# Altium schematic sheet Sheet1.SchDoc
size A; SheetNumber: 1; SheetTotal: 1
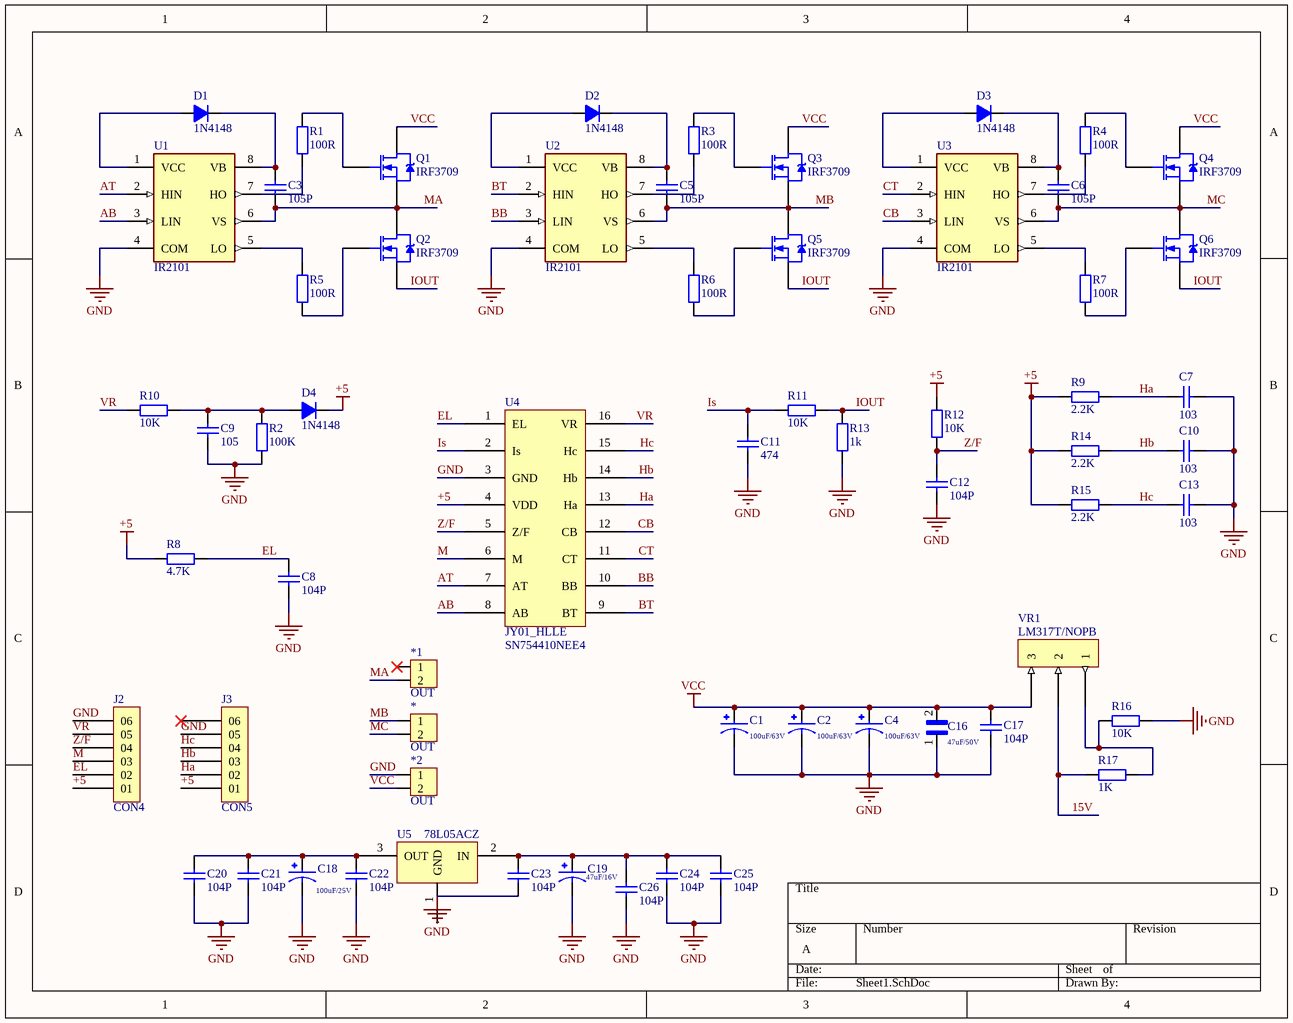
[diagram p0: Sheet1.SchDoc]

## Parts
*  OUT  [VH3.96M-2 CONG]
*1  OUT  [VH3.96M-2 CONG]
*2  OUT  [VH3.96M-2 CONG]
C1  100uF/63V  [CAP_EEVTG1J101Q]
C2  100uF/63V  [CAP_EEVTG1J101Q]
C3  105P  [tu 0805]
C4  100uF/63V  [CAP_EEVTG1J101Q]
C5  105P  [tu 0805]
C6  105P  [tu 0805]
C7  103  [tu 0805]
C8  104P  [tu 0805]
C9  105  [tu 0805]
C10  103  [tu 0805]
C11  474  [tu 0805]
C12  104P  [tu 0805]
C13  103  [tu 0805]
C16  47uF/50V  [CAPC6050X550N]
C17  104P  [tu 0805]
C18  100uF/25V  [CAP_EEEHA1E101AP]
C19  47uF/16V  [CAP_EEE1CA470AP]
C20  104P  [tu 0805]
C21  104P  [tu 0805]
C22  104P  [tu 0805]
C23  104P  [tu 0805]
C24  104P  [tu 0805]
C25  104P  [tu 0805]
C26  104P  [tu 0805]
D1  1N4148  [DIODE 0.5A]
D2  1N4148  [DIODE 0.5A]
D3  1N4148  [DIODE 0.5A]
D4  1N4148  [DIODE 0.5A]
J2  CON4  [VALCON_VH396-06S-010]
J3  CON5  [VALCON_VH396-06S-010]
Q1  IRF3709  [TO220]
Q2  IRF3709  [TO220]
Q3  IRF3709  [TO220]
Q4  IRF3709  [TO220]
Q5  IRF3709  [TO220]
Q6  IRF3709  [TO220]
R1  100R  [tro smd 0805]
R2  100K  [tro smd 0805]
R3  100R  [tro smd 0805]
R4  100R  [tro smd 0805]
R5  100R  [tro smd 0805]
R6  100R  [tro smd 0805]
R7  100R  [tro smd 0805]
R8  4.7K  [tro smd 0805]
R9  2.2K  [tro smd 0805]
R10  10K  [tro smd 0805]
R11  10K  [tro smd 0805]
R12  10K  [tro smd 0805]
R13  1k  [tro smd 0805]
R14  2.2K  [tro smd 0805]
R15  2.2K  [tro smd 0805]
R16  10K  [tro smd 0805]
R17  1K  [tro smd 0805]
U1  IR2101  [DIL08]
U2  IR2101  [DIL08]
U3  IR2101  [DIL08]
U4  SN754410NEE4  [DIP762W45P254L1980H508Q16]
U5  78L05ACZ  [TO-92]
VR1  LM317T/NOPB  [TO254P1054X470X1955-3]

## Nets
+5: D4.2(K) J2.01 J3.01 R8.1 R9.1 R12.2 R14.1 R15.1 U4.4(VDD)
GND: *2.1 C1.2 C2.2 C4.2 C7.2 C8.1 C9.2 C10.2 C11.2 C12.2 C13.2 C16.1 C17.2 C18.2 C19.2 C20.2 C21.2 C22.2 C23.2 C24.2 C25.2 C26.2 J2.06 J3.05 R2.1 R13.1 R16.2 U1.4(COM) U2.4(COM) U3.4(COM) U4.3(GND)
VCC: *2.2 C1.1 C2.1 C4.1 C16.2 C17.1 Q1.2(D) Q3.2(D) Q4.2(D) VR1.Input(3)
15V: R17.1 VR1.Output(2)
AB: U1.3(LIN) U4.8(AB)
AT: U1.2(HIN) U4.7(AT)
BB: U2.3(LIN) U4.10(BB)
BT: U2.2(HIN) U4.9(BT)
CB: U3.3(LIN) U4.12(CB)
CT: U3.2(HIN) U4.11(CT)
EL: C8.2 J2.02 R8.2 U4.1(EL)
Ha: C7.1 J3.02 R9.2 U4.13(Ha)
Hb: C10.1 J3.03 R14.2 U4.14(Hb)
Hc: C13.1 J3.04 R15.2 U4.15(Hc)
IOUT: Q2.3(S) Q5.3(S) Q6.3(S) R11.2 R13.2
Is: C11.1 R11.1 U4.2(Is)
M: J2.03 U4.6(M)
MA: *1.2 C3.2 Q1.3(S) Q2.2(D) U1.6(VS)
MB: *.1 C5.2 Q3.3(S) Q5.2(D) U2.6(VS)
MC: *.2 C6.2 Q4.3(S) Q6.2(D) U3.6(VS)
VR: J2.05 R10.1 U4.16(VR)
Z/F: C12.1 J2.04 R12.1 U4.5(Z/F)
NetC3_1: C3.1 D1.2(K) U1.8(VB)
NetC5_1: C5.1 D2.2(K) U2.8(VB)
NetC6_1: C6.1 D3.2(K) U3.8(VB)
NetC9_1: C9.1 D4.1(A) R2.2 R10.2
NetC18_1: C18.1 C20.1 C21.1 C22.1 U5.3(OUT)
NetC19_1: C19.1 C23.1 C24.1 C25.1 C26.1 U5.2(IN)
NetD1_1: D1.1(A) U1.1(VCC)
NetD2_1: D2.1(A) U2.1(VCC)
NetD3_1: D3.1(A) U3.1(VCC)
NetQ1_1: Q1.1(G) R1.2
NetQ2_1: Q2.1(G) R5.1
NetQ3_1: Q3.1(G) R3.2
NetQ4_1: Q4.1(G) R4.2
NetQ5_1: Q5.1(G) R6.1
NetQ6_1: Q6.1(G) R7.1
NetR1_1: R1.1 U1.7(HO)
NetR3_1: R3.1 U2.7(HO)
NetR4_1: R4.1 U3.7(HO)
NetR5_2: R5.2 U1.5(LO)
NetR6_2: R6.2 U2.5(LO)
NetR7_2: R7.2 U3.5(LO)
NetR16_1: R16.1 R17.2 VR1.ADJ(1)

Not connected (* = marked no-connect by the designer): *1 1*; J3 06*; U5 1(GND)

## Notes on the sheet
- (in symbol SN754410NEE4) JY01_HLLE

## Library data of the parts
* *1 *2 = Header 2P VH3.96 Duc Cong
C1 C2 C4 = EEVTG1J101Q: 100ÂµF 63V Aluminum Electrolytic Capacitors Radial, Can - SMD 260mOhm @ 100kHz 2000 Hrs @ 125Â°C; MF: Panasonic; Purchase-URL: https://pricing.snapeda.com/search/part/EEVTG1J101Q/?ref=eda; Package: RADIAL-2 Panasonic; MP: EEVTG1J101Q; Value: *; SnapEDA_Link: https://www.snapeda.com/parts/EEVTG1J101Q/Panasonic/view-part/?ref=snap; Availability: In Stock; Price: None; Check_prices: https://www.snapeda.com/parts/EEVTG1J101Q/Panasonic/view-part/?ref=eda
C3 C5 C6 C8 C9 C11 C12 C20-C26 = Tu 0805 472 50V 20%: Dán; Don_Vi: Con; So_Chan: 2; Ten_Linh_Kien: Tụ 0805 472-4.7nF 20% 50V; Ma_Hang: MH004363; Chung_Loai: Dán; Kieu_Chan: *
C7 C10 C13 = Tu 0805 471 50V 10%: Dán; Don_Vi: Con; So_Chan: 2; Ten_Linh_Kien: Tụ 0805 471-470 10% 50V; Ma_Hang: MH004564; Chung_Loai: Dán; Kieu_Chan: *
C16 = CKG57NX7R1H476M500JJ: MF: TDK; Value: *; Package: 6050 TDK; Purchase-URL: https://pricing.snapeda.com/search/part/CKG57NX7R1H476M500JJ/?ref=eda; Check_prices: https://www.snapeda.com/parts/CKG57NX7R1H476M500JJ/TDK/view-part/?ref=eda; Price: None; MP: CKG57NX7R1H476M500JJ; Availability: In Stock; SnapEDA_Link: https://www.snapeda.com/parts/CKG57NX7R1H476M500JJ/TDK/view-part/?ref=snap
C17 = Tu 0805 472 50V 20%: Tu 0805 472 50V 20% / SMD /; Chung_Loai: Dán; Don_Vi: Con; So_Chan: 2; Ten_Linh_Kien: Tụ 0805 472-4.7nF 20% 50V; Ma_Hang: MH004363; Kieu_Chan: *
C18 = EEEHA1E101AP: 100ÂµF 25V Aluminum Electrolytic Capacitors Radial, Can - SMD 1000 Hrs @ 105Â°C; MF: Panasonic; MP: EEE-HA1E101AP; SnapEDA_Link: https://www.snapeda.com/parts/EEE-HA1E101AP/Panasonic/view-part/?ref=snap; Availability: In Stock; Purchase-URL: https://pricing.snapeda.com/search/part/EEE-HA1E101AP/?ref=eda; Check_prices: https://www.snapeda.com/parts/EEE-HA1E101AP/Panasonic/view-part/?ref=eda; Value: *; Package: RADIAL-2 Panasonic; Price: None
C19 = EEE1CA470AP: 47ÂµF 16V Aluminum Electrolytic Capacitors Radial, Can - SMD 2000 Hrs @ 85Â°C; MP: EEE-1CA470AP; MF: Panasonic; Availability: In Stock; Check_prices: https://www.snapeda.com/parts/EEE-1CA470AP/Panasonic/view-part/?ref=eda; SnapEDA_Link: https://www.snapeda.com/parts/EEE-1CA470AP/Panasonic/view-part/?ref=snap; Price: None; Value: *; Purchase-URL: https://pricing.snapeda.com/search/part/EEE-1CA470AP/?ref=eda; Package: RADIAL-2 Panasonic
D1-D4 = Diode 1N4148: Cắm; Ten_Linh_Kien: Diode 1N4148 DO35 450mA 100V ( 1N4148 DIP); Don_Vi: Con; Ma_Hang: MH001065; Ghi Chu: *; Kieu_Chan: *; Chung_Loai: Cắm
J2 J3 = VH396-06S-010: VH396 - Valcon 3.96mm 5A Wire-to-Board Straight Locking Power Connector; Value: *; MF: Valcon; MP: VH396-06S-010; Price: None; Package: None; Check_prices: https://www.snapeda.com/parts/VH396-06S-010/Valcon/view-part/?ref=eda; Availability: In Stock; SnapEDA_Link: https://www.snapeda.com/parts/VH396-06S-010/Valcon/view-part/?ref=snap; Purchase-URL: https://pricing.snapeda.com/search/part/VH396-06S-010/?ref=eda
Q1-Q6 = IRF3709 DIP: N-Channel Power MOSFET
R1-R17 = Tro 0805 1% 1k: Dán; Don_Vi: Con; So_Chan: 2; Ten_Linh_Kien: Trở 0805 1% 1k; Ma_Hang: MH005468; Chung_Loai: Dán; Kieu_Chan: *
U1-U3 = IR2101: Half-Bridge Gate Driver IC Non-Inverting 8-PDIP; MF: Infineon; Purchase-URL: https://pricing.snapeda.com/search/part/IR2101/?ref=eda; Package: DIP-8 International Rectifier; Check_prices: https://www.snapeda.com/parts/IR2101/Infineon+Technologies/view-part/?ref=eda; Value: *; SnapEDA_Link: https://www.snapeda.com/parts/IR2101/Infineon+Technologies/view-part/?ref=snap; MP: IR2101; Digi-Key_Part_Number: IR2101-ND
U4 = SN754410NEE4: Quadruple Half-H Drivers 16-PDIP -40 to 85; MF: Texas Instruments; Availability: In Stock; SnapEDA_Link: https://www.snapeda.com/parts/SN754410NEE4/Texas+Instruments/view-part/?ref=snap; MP: SN754410NEE4; Value: *; Price: None; Package: PDIP-16 Texas Instruments; Purchase-URL: https://pricing.snapeda.com/search/part/SN754410NEE4/?ref=eda; Check_prices: https://www.snapeda.com/parts/SN754410NEE4/Texas+Instruments/view-part/?ref=eda
U5 = 78L05ACZ: Linear Voltage Regulator IC Positive Fixed 1 Output 100mA TO-92-3; MF: STMicroelectronics; SnapEDA_Link: https://www.snapeda.com/parts/78L05ACZ/STMicroelectronics/view-part/?ref=snap; Package: TO-92 ON; MP: 78L05ACZ; Check_prices: https://www.snapeda.com/parts/78L05ACZ/STMicroelectronics/view-part/?ref=eda; Purchase-URL: https://pricing.snapeda.com/search/part/78L05ACZ/?ref=eda; Price: None; Value: *; Availability: In Stock
VR1 = LM317T/NOPB: Linear Voltage Regulator IC Positive Adjustable 1 Output 1.5A TO-220-3; pin to pad: ADJ>1 Input>3 Output>2; MF: STMicroelectronics; MP: LM317T; SnapEDA_Link: https://www.snapeda.com/parts/LM317T/STMicroelectronics/view-part/?ref=snap; Package: TO-220-3 STMicroelectronics; Value: *; Check_prices: https://www.snapeda.com/parts/LM317T/STMicroelectronics/view-part/?ref=eda